# EAGLE design Geiger (EAGLE 6.5.0)
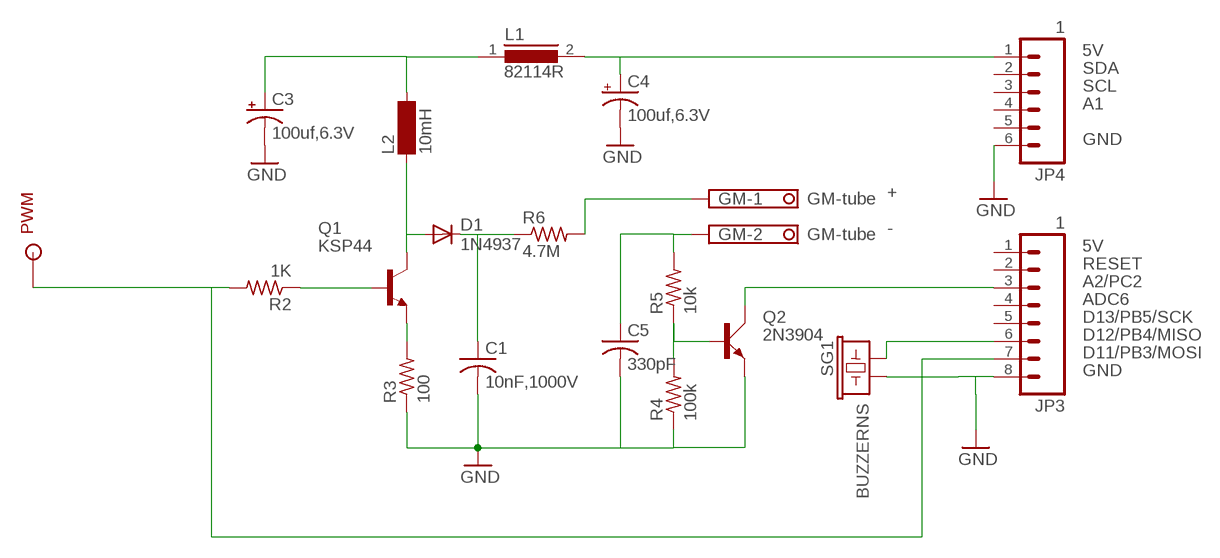
[diagram p0: schematic, sheet 1]

## Parts
C1  10nF,1000V  C-US150-054X183  [C150-054X183]
C3  100uf,6.3V  CPOL-USE2.5-7  [E2,5-7]
C4  100uf,6.3V  CPOL-USE2.5-7  [E2,5-7]
C5  330pF  C-US050-045X075  [C050-045X075]
D1  1N4937  1N4933  [DO41-10]
GM  GM-tube  1751248  [1751248]
JP3  1  M081X08  [1X08]
JP4  1  M06SIP  [1X06]
L1  82114R  [82114R]
L2  10mH  BS11  [BS11]
PWM  SOLDER_POINTA  [P1-13]
Q1  KSP44  BC550B  [TO92-EBC]
Q2  2N3904  [TO92D]
R2  1K  R-US_0207/10  [0207/10]
R3  100  R-US_0207/10  [0207/10]
R4  100k  R-US_0207/10  [0207/10]
R5  10k  R-US_0207/10  [0207/10]
R6  4.7M  R-US_0207/10  [0207/10]
SG1  BUZZERNS  [BUZZER-12MM-NS]

## Nets
+5V: C4.+ JP4.1 L1.2
GND: C1.2 C3.- C4.- C5.2 JP3.8 JP4.6 Q2.E R3.1 R4.1 SG1.-
N$1: JP3.7 PWM.1 R2.2
N$2: Q1.B R2.1
N$3: JP3.6 SG1.+
N$5: Q1.E R3.2
N$6: D1.A L2.1 Q1.C
N$9: C1.1 D1.C R6.1
N$10: GM.1 R6.2
N$11: Q2.B R4.2 R5.1
N$12: C3.+ L1.1 L2.2
N$13: C5.1 GM.2 R5.2
RESET: JP3.3 Q2.C
Unconnected: JP3.1 JP3.2 JP3.4 JP3.5 JP4.2 JP4.3 JP4.4 JP4.5

## Notes on the sheet
- 5V
- SDA
- SCL
- A1
- GND
- +
- -
- 5V
- A2/PC2
- ADC6
- D13/PB5/SCK
- D12/PB4/MISO
- D11/PB3/MOSI
- GND

## Library data of the parts
C1 C5 = rcl:C-US: CAPACITOR, American symbol
C3 C4 = rcl:CPOL-US: POLARIZED CAPACITOR, American symbol
D1 = diode:1N4933: DIODE fast recovery rectifier, 1A
GM = con-phoenix-350:1751248: MKDS 1/ 2-3,5 Printklemme Nennstrom: 10 A Bemessungsspannung: 160 V Raster: 3,5 mm Polzahl: 2 Montageart: Löten Anschlussart: Schraubanschluss Anschlussrichtung vom Leiter zur Platine: 0° Source: http://eshop.phoenixcontact.com .. 1751248.pdf; OC_FARNELL: unknown; OC_NEWARK: unknown
JP3 = SparkFun-Connectors:M08: Header 8 Standard 8-pin 0.1" header. Use with straight break away headers (SKU : PRT-00116), right angle break away headers (PRT-00553), swiss pins (PRT-00743), machine pins (PRT-00117), and female headers (PRT-00115).
JP4 = SparkFun-Connectors:M06: Header 6 Standard 6-pin 0.1" header. Use with straight break away headers (SKU : PRT-00116), right angle break away headers (PRT-00553), swiss pins (PRT-00743), machine pins (PRT-00117), and female headers (PRT-00115). Molex polarized connector foot print use with SKU : PRT-08094 with associated crimp pins and housings. NOTES ON THE VARIANTS LOCK and LOCK_LONGPADS... This footprint was designed to help hold the alignment of a through-hole component (i.e. 6-pin header) while soldering it into place. You may notice that each hole has been shifted either up or down by 0.005 of an inch from it's more standard position (which is a perfectly straight line). This slight alteration caused the pins (the squares in the middle) to touch the edges of the holes. Because they are alternating, it causes a "brace" to hold the component in place. 0.005 has proven to be the perfect amount of "off-center" position when using our standard breakaway headers. Although looks a little odd when you look at the bare footprint, once you have a header in there, the alteration is very hard to notice. Also, if you push a header all the way into place, it is covered up entirely on the bottom side. This idea of altering the position of holes to aid alignment will be further integrated into the Sparkfun Library for other footprints. It can help hold any component with 3 or more connection pins.
L1 = inductors:82114R: INDUCTOR
L2 = inductor-neosid:BS: INDUCTOR nominal inductance, magnetically screened; OC_FARNELL: unknown; OC_NEWARK: unknown
PWM = 1AA_Stofer:SOLDER_POINT
Q1 = transistor-npn:BC550*: NPN Transistor
Q2 = transistor-small-signal:2N3904: NPN TRANSISTOR
R2-R6 = rcl:R-US_: RESISTOR, American symbol
SG1 = SparkFun-Electromechanical:BUZZER: Buzzer 12mm Spark Fun Electronics SKU : Comp-Buzzer

## Net classes
1 vcc: width 0.254 mm

## Board
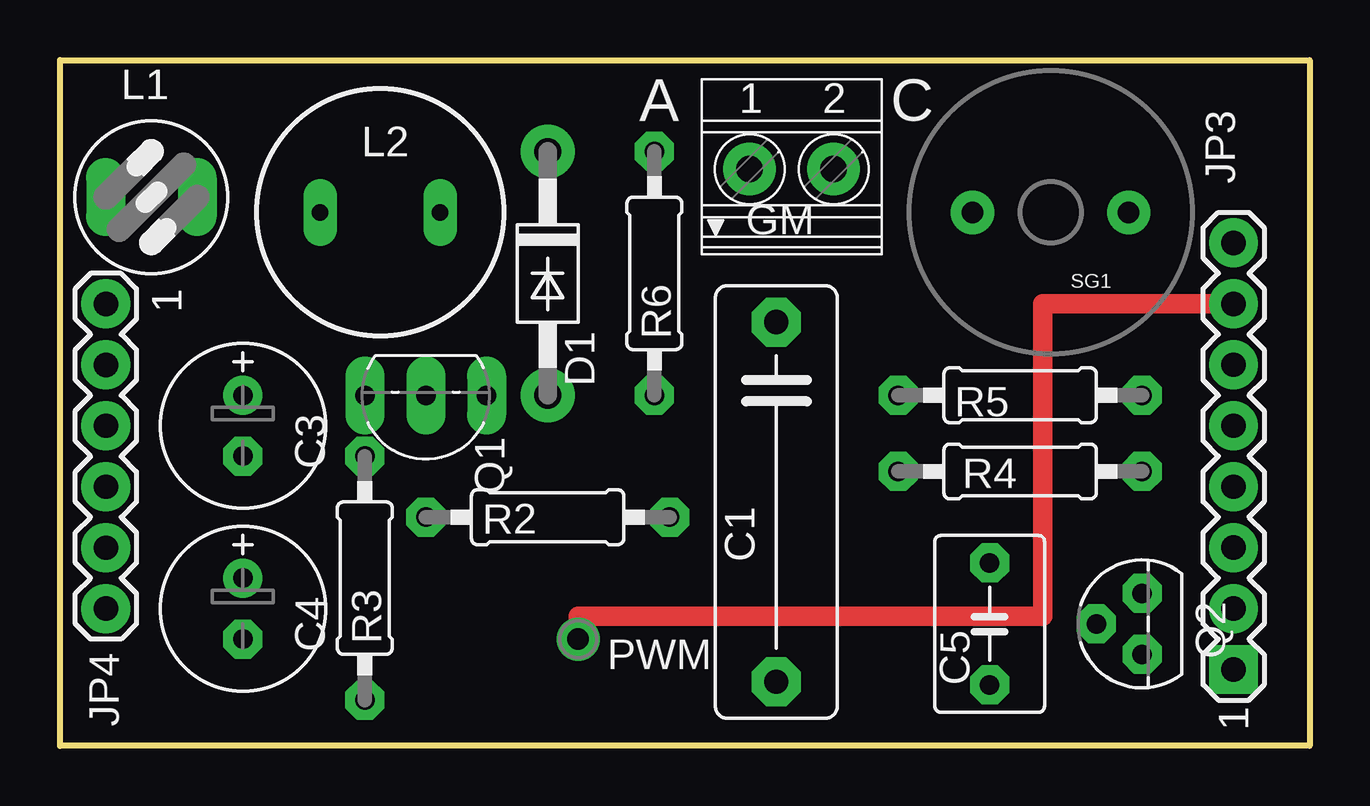
[diagram p1: board, top side]
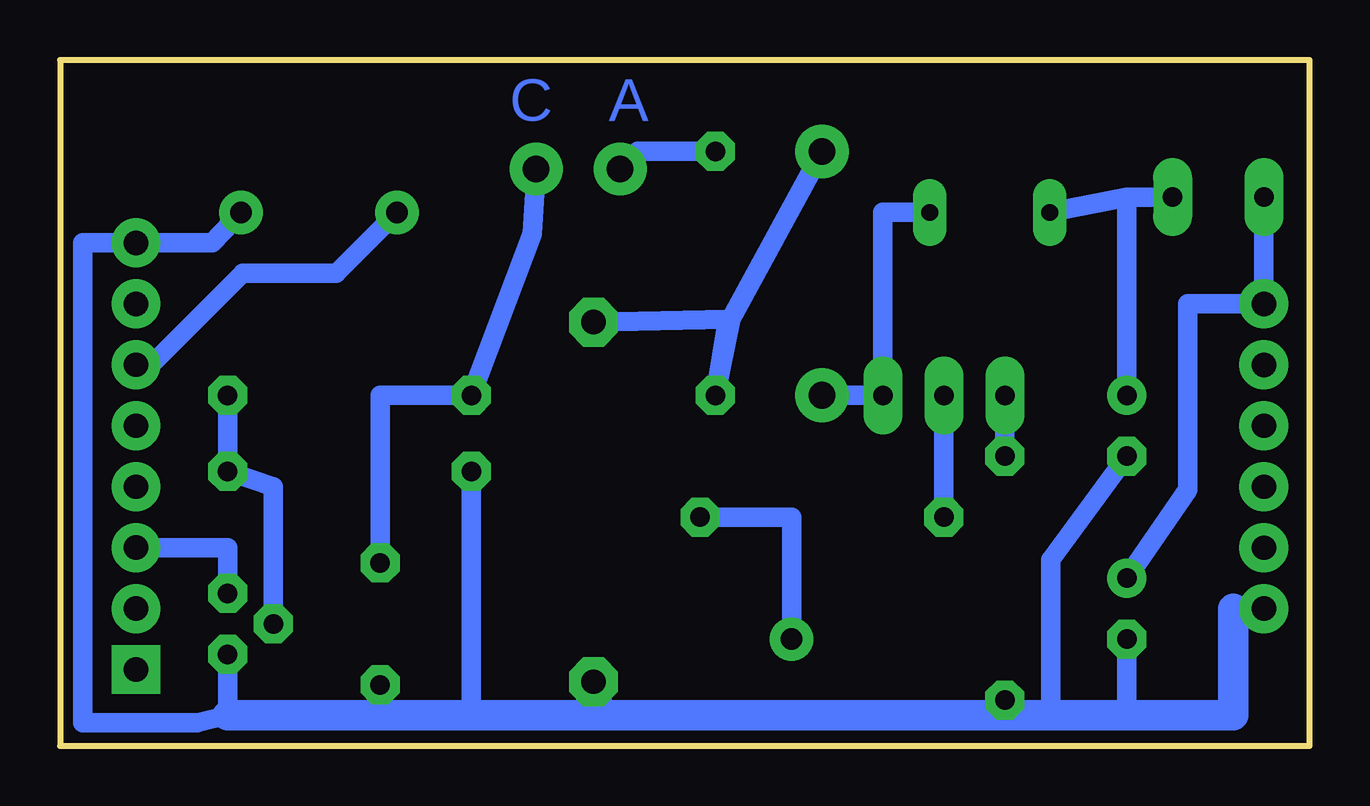
[diagram p2: board, bottom side, seen from below]

Size 52.07 x 28.58 mm. Coordinates in mm from the lower left corner, seen from the top.
Outline: 0,28.58 52.07,28.58 52.07,0 0,0 0,28.58
Copper layers (1*16): Top 0.0356mm / dielectric 1.5011mm / Bottom 0.0356mm
Design rules "OSH *": minimum track width 6mil, minimum drill 13mil, track to track 6mil, track to pad 6mil, pad to pad 6mil, via to via 6mil, smd to smd 6mil, copper to edge 15mil, drill to drill 6mil, minimum pad ring 10mil, minimum via ring 9mil, stop-mask expansion 3mil, vias tented up to drill 0mil, thermal gap 10mil

### Footprints (pad centres in the part's own frame; a part is rotated, then mirrored left to right if it is on the bottom)
C150-054X183 = drill 1.016 octagon: 1 -7.493,0; 2 7.493,0
E2,5-7 = drill 0.813 pad 1.6: + -1.27,0 | drill 0.813 pad 1.6 octagon: - 1.27,0
C050-045X075 = drill 0.813 octagon: 1 -2.54,0; 2 2.54,0
DO41-10 = drill 1.118: A 5.08,0; C -5.08,0
1751248 = drill 1.1 pad 1.7: 1 -1.75,-0.1; 2 1.75,-0.1
1X08 = drill 1.016 pad 1.88 square: 1 0,0 | drill 1.016 pad 1.88: 2 2.54,0; 3 5.08,0; 4 7.62,0; 5 10.16,0; 6 12.7,0; 7 15.24,0; 8 17.78,0
1X06 = drill 1.016 pad 1.88: 1 0,0; 2 2.54,0; 3 5.08,0; 4 7.62,0; 5 10.16,0; 6 12.7,0
82114R = drill 0.813 long: 1 0,1.905; 2 0,-1.905
BS11 = drill 0.7 long: 1 -2.5,0; 2 2.5,0
P1-13 = drill 0.9: 1 0,0
TO92-EBC = drill 0.813 long: B 0,-1.27; C -2.54,-1.27; E 2.54,-1.27
TO92D = drill 0.813 octagon: B 0,1.905; C 1.27,0; E -1.27,0
0207/10 = drill 0.813 octagon: 1 -5.08,0; 2 5.08,0
BUZZER-12MM-NS = drill 0.9: + 3.25,0; - -3.25,0

### Placement (x,y rotation side)
C1  29.84,10.16 270 top
C3  7.62,13.34 270 top
C4  7.62,5.71 270 top
C5  38.73,5.08 270 top
D1  20.32,19.69 270 top
GM  30.48,24.13 0 top
JP3  48.9,3.18 90 top
JP4  1.91,18.41 270 top
L1  3.81,22.86 270 top
L2  13.33,22.23 180 top
PWM  21.59,4.45 0 top
Q1  15.24,13.34 180 top
Q2  45.09,5.08 90 top
R2  20.32,9.52 0 top
R3  12.7,6.98 90 top
R4  40,11.43 0 top
R5  40,14.61 180 top
R6  24.77,19.69 90 top
SG1  41.27,22.23 180 top

### Tracks (layer width: path | path; a pad name or v marks a point on that pad's centre or on a via)
+5V
  Bottom 0.508: JP4.1
  Bottom 0.813: JP4.1 L1.2 | C4.+ 5.08,10.67 5.08,18.41 JP4.1
GND
  Bottom 0.406: 48.26,20.95 JP3.8 | JP3.8
  Bottom 0.813: C3.- 10.79,7.75 10.79,1.27 | C4.- 7.62,1.27 | C1.2 29.21,1.27 | C5.2 38.73,1.27 | Q2.E 45.09,1.27 46.35,0.95 51.12,0.95 51.12,20.95 JP3.8 45.72,20.95 | R3.1 13.33,1.27 | SG1.- 45.72,20.95 | 45.72,20.95 | R4.1 34.92,1.27
  Bottom 1.016: JP4.6 3.18,5.71
  Bottom 1.27: 3.18,5.71 3.18,1.27 7.62,1.27 10.79,1.27 13.33,1.27 29.21,1.27 34.92,1.27 38.73,1.27 45.09,1.27
N$1
  Top 0.813: JP3.7 48.58,18.41 40.96,18.41 40.96,5.4 21.59,5.4 PWM.1
  Bottom 0.813: R2.2 21.59,9.52 PWM.1
N$2
  Bottom 0.813: Q1.B R2.1
N$3
  Bottom 0.813: JP3.6 48.26,15.88 44.45,19.69 40.56,19.69 SG1.+
N$5
  Bottom 0.813: Q1.E R3.2
N$6
  Bottom 0.813: L2.1 17.78,22.23 Q1.C D1.A
N$9
  Bottom 0.813: D1.C 24.13,17.78 R6.1 24.26,17.78 C1.1
N$10
  Bottom 0.813: R6.2 27.99,24.77 GM.1
N$11
  Bottom 0.813: R5.1 R4.2 43.18,10.8 Q2.B
N$12
  Bottom 0.813: 7.62,22.86 L1.1 | L2.2 7.62,22.86 | 7.62,22.86 C3.+
N$13
  Bottom 0.813: GM.2 32.38,21.34 R5.2 38.73,14.61 C5.1
RESET
  Bottom 0.813: Q2.C 45.09,8.25 JP3.3

### Text on the board
Bottom: A | C
tPlace: A | C